# EAGLE design mixer1_1st auto route (EAGLE 7.3.0)
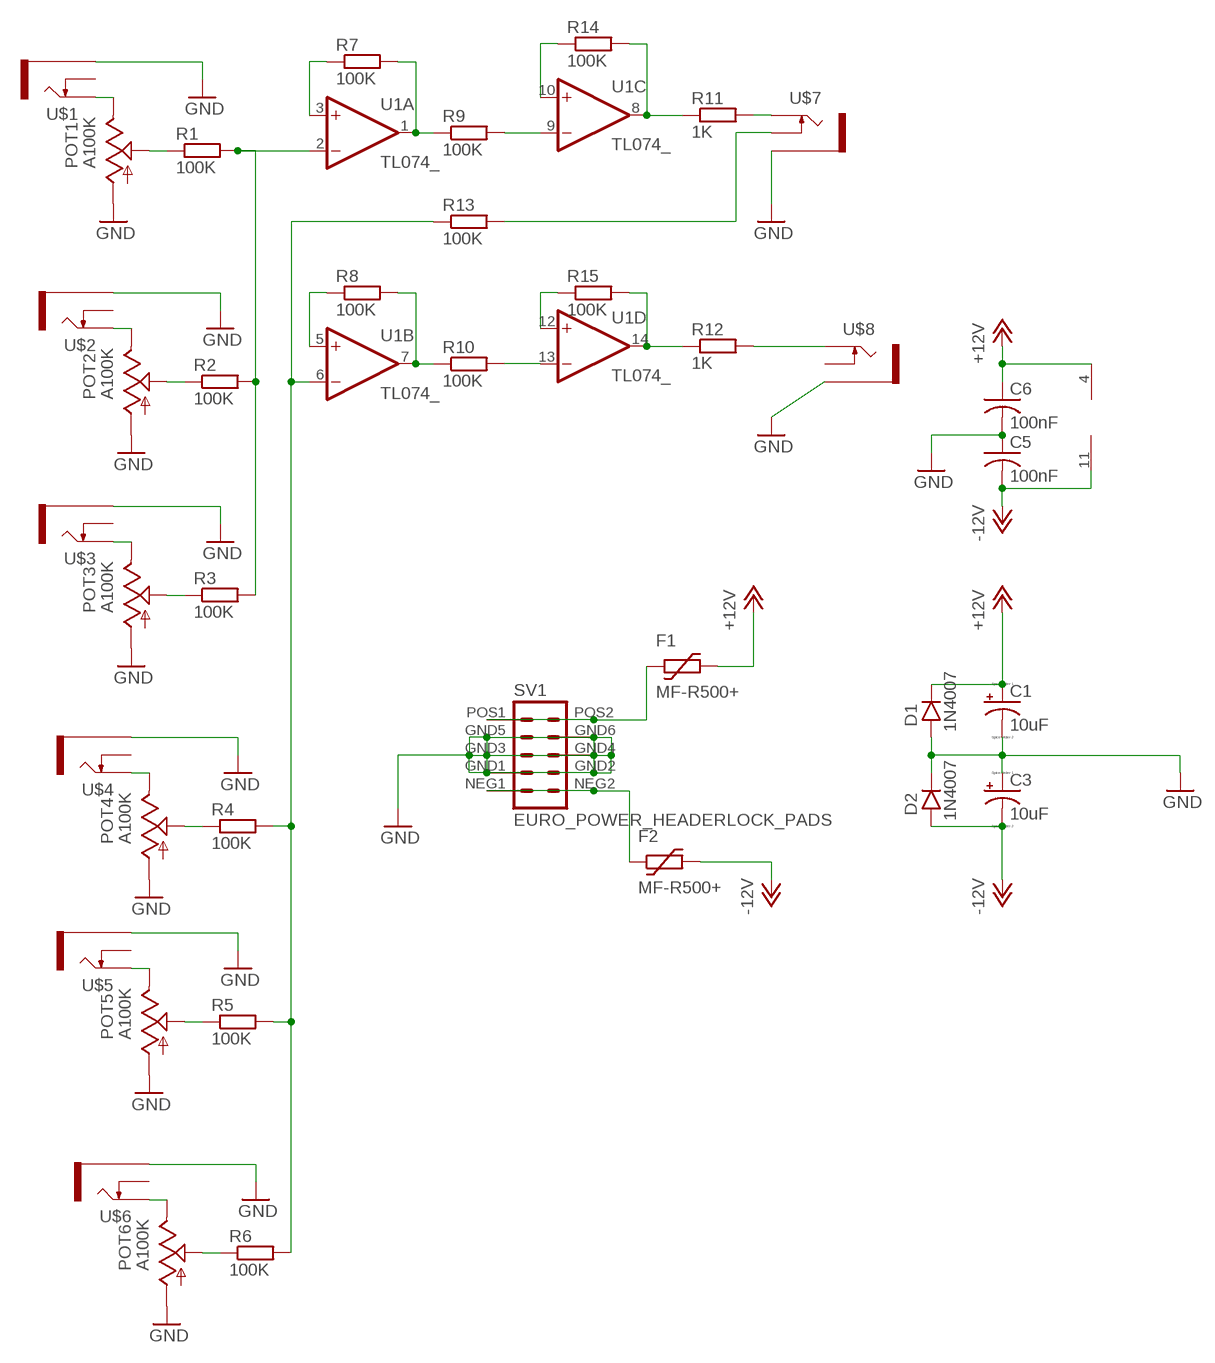
[diagram p0: schematic, sheet 1]

## Parts
C1  10uF  CPOL-USE2.5-7  [E2,5-7]
C3  10uF  CPOL-USE2.5-7  [E2,5-7]
C5  100nF  C-US075-032X103  [C075-032X103]
C6  100nF  C-US075-032X103  [C075-032X103]
D1  1N4007  1N400X.3  [DO41-3]
D2  1N4007  1N400X.3  [DO41-3]
F1  MF-R500+  [BOURNS-MF-R]
F2  MF-R500+  [BOURNS-MF-R]
POT1  A100K  9MM_SNAP-IN_POT_  [9MM_SNAP-IN_POT]
POT2  A100K  9MM_SNAP-IN_POT_  [9MM_SNAP-IN_POT]
POT3  A100K  9MM_SNAP-IN_POT_  [9MM_SNAP-IN_POT]
POT4  A100K  9MM_SNAP-IN_POT_  [9MM_SNAP-IN_POT]
POT5  A100K  9MM_SNAP-IN_POT_  [9MM_SNAP-IN_POT]
POT6  A100K  9MM_SNAP-IN_POT_  [9MM_SNAP-IN_POT]
R1  100K  RESISTOR7MM  [7MM_RESISTOR]
R2  100K  RESISTOR7MM  [7MM_RESISTOR]
R3  100K  RESISTOR7MM  [7MM_RESISTOR]
R4  100K  RESISTOR7MM  [7MM_RESISTOR]
R5  100K  RESISTOR7MM  [7MM_RESISTOR]
R6  100K  RESISTOR7MM  [7MM_RESISTOR]
R7  100K  RESISTOR7MM  [7MM_RESISTOR]
R8  100K  RESISTOR7MM  [7MM_RESISTOR]
R9  100K  RESISTOR7MM  [7MM_RESISTOR]
R10  100K  RESISTOR7MM  [7MM_RESISTOR]
R11  1K  RESISTOR7MM  [7MM_RESISTOR]
R12  1K  RESISTOR7MM  [7MM_RESISTOR]
R13  100K  RESISTOR7MM  [7MM_RESISTOR]
R14  100K  RESISTOR7MM  [7MM_RESISTOR]
R15  100K  RESISTOR7MM  [7MM_RESISTOR]
SV1  EURO_POWER_HEADERLOCK_PADS  [EURO_PWR_HEADER_LOCK]
U1  TL074_  [DIL14]
U$1  THONKICONNNEW  [WQP-PJ301M-12_JACK]
U$2  THONKICONNNEW  [WQP-PJ301M-12_JACK]
U$3  THONKICONNNEW  [WQP-PJ301M-12_JACK]
U$4  THONKICONNNEW  [WQP-PJ301M-12_JACK]
U$5  THONKICONNNEW  [WQP-PJ301M-12_JACK]
U$6  THONKICONNNEW  [WQP-PJ301M-12_JACK]
U$7  THONKICONNNEW  [WQP-PJ301M-12_JACK]
U$8  THONKICONNNEW  [WQP-PJ301M-12_JACK]

## Nets
+12V: C1.+ C6.1 D1.C F1.P$2 U1.4(P:V+)
-12V: C3.- C5.2 D2.A F2.P$2 U1.11(P:V-)
GND: C1.- C3.+ C5.1 C6.2 D1.A D2.C POT1.1(A) POT2.1(A) POT3.1(A) POT4.1(A) POT5.1(A) POT6.1(A) SV1.GND1 SV1.GND2 SV1.GND3 SV1.GND4 SV1.GND5 SV1.GND6 U$1.P$3_SLEEVE(SLEEVE) U$2.P$3_SLEEVE(SLEEVE) U$3.P$3_SLEEVE(SLEEVE) U$4.P$3_SLEEVE(SLEEVE) U$5.P$3_SLEEVE(SLEEVE) U$6.P$3_SLEEVE(SLEEVE) U$7.P$3_SLEEVE(SLEEVE) U$8.P$3_SLEEVE(SLEEVE)
N$1: POT2.3(E) U$2.P$1_TIP(TIP)
N$2: POT2.2(S) R2.1
N$3: POT1.3(E) U$1.P$1_TIP(TIP)
N$4: POT1.2(S) R1.1
N$5: POT3.3(E) U$3.P$1_TIP(TIP)
N$6: POT3.2(S) R3.1
N$7: POT4.3(E) U$4.P$1_TIP(TIP)
N$8: POT4.2(S) R4.1
N$9: POT5.3(E) U$5.P$1_TIP(TIP)
N$10: POT5.2(S) R5.1
N$11: POT6.3(E) U$6.P$1_TIP(TIP)
N$12: POT6.2(S) R6.1
N$13: R1.2 R2.2 R3.2 U1.2(A:-IN)
N$14: R7.1 U1.3(A:+IN)
N$15: R7.2 R9.1 U1.1(A:OUT)
N$16: R9.2 U1.9(C:-IN)
N$17: R14.1 U1.10(C:+IN)
N$18: R11.2 U$7.P$1_TIP(TIP)
N$19: R8.2 R10.1 U1.7(B:OUT)
N$20: R8.1 U1.5(B:+IN)
N$21: R15.1 U1.12(D:+IN)
N$22: R12.1 R15.2 U1.14(D:OUT)
N$23: R10.2 U1.13(D:-IN)
N$24: R4.2 R5.2 R6.2 R13.1 U1.6(B:-IN)
N$25: R11.1 R14.2 U1.8(C:OUT)
N$26: R13.2 U$7.P$2_SWITCH(SWITCH)
N$27: R12.2 U$8.P$1_TIP(TIP)
N$31: F2.P$1 SV1.NEG1 SV1.NEG2
N$32: F1.P$1 SV1.POS1 SV1.POS2
Unconnected: U$1.P$2_SWITCH(SWITCH) U$2.P$2_SWITCH(SWITCH) U$3.P$2_SWITCH(SWITCH) U$4.P$2_SWITCH(SWITCH) U$5.P$2_SWITCH(SWITCH) U$6.P$2_SWITCH(SWITCH) U$8.P$2_SWITCH(SWITCH)

## Library data of the parts
C1 C3 = resistor:CPOL-US: POLARIZED CAPACITOR, American symbol
C5 C6 = resistor:C-US: CAPACITOR, American symbol
D1 D2 = gm-diodes:1N400X: Rectifier Diodes often used in power supply to prevent damage from reverse polarization
F1 F2 = ptc-littlefuse:MF-R500+: http://www.farnell.com/datasheets/1817521.pdf
POT1-POT6 = MusicThingModular:9MM_SNAP-IN_POT: 9mm vertical snap-in pot, Alpha / Panasonic style
R1-R15 = MusicThingModular:RESISTOR: Standard resistor, various versions
SV1 = MusicThingModular:EURO_POWER_HEADER: Power Header 10 pin power header for Eurorack Power Supplies Variants with fatter pads for easier soldering, and the LOCK variant which has 5mil offset pins to hold the component in place before soldering
U1 = MusicThingModular:TL074: Generic Quad Op Amp
U$1-U$8 = MusicThingModular:THONKICONN: 3.5mm socket for Eurorack modular synths

## Board
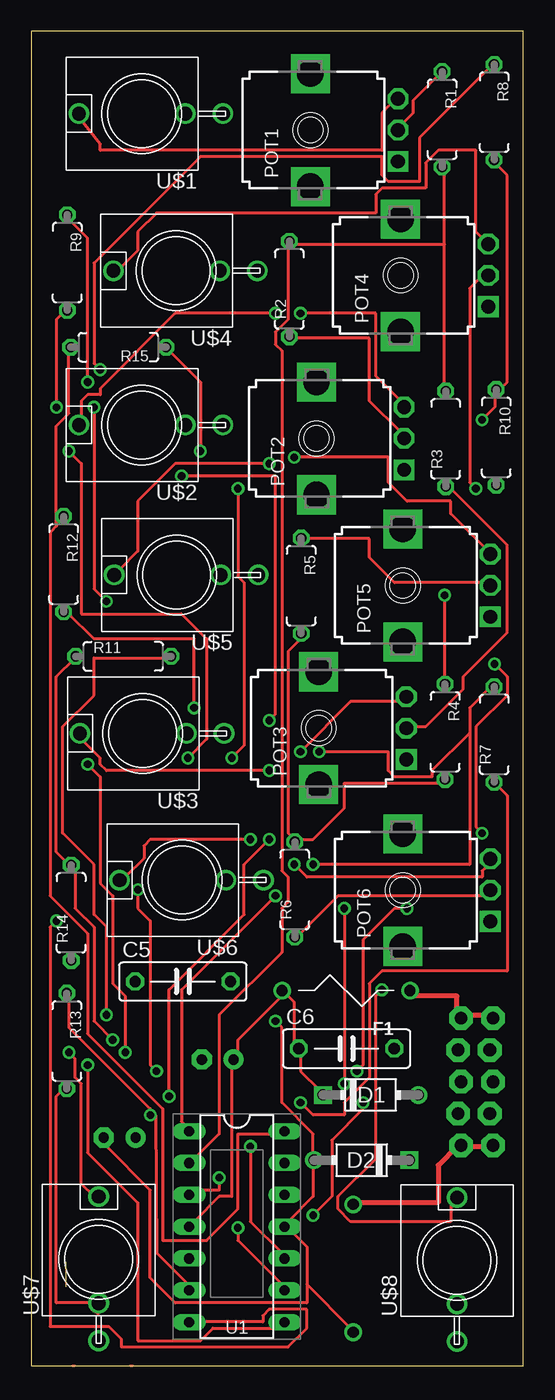
[diagram p1: board, top side]
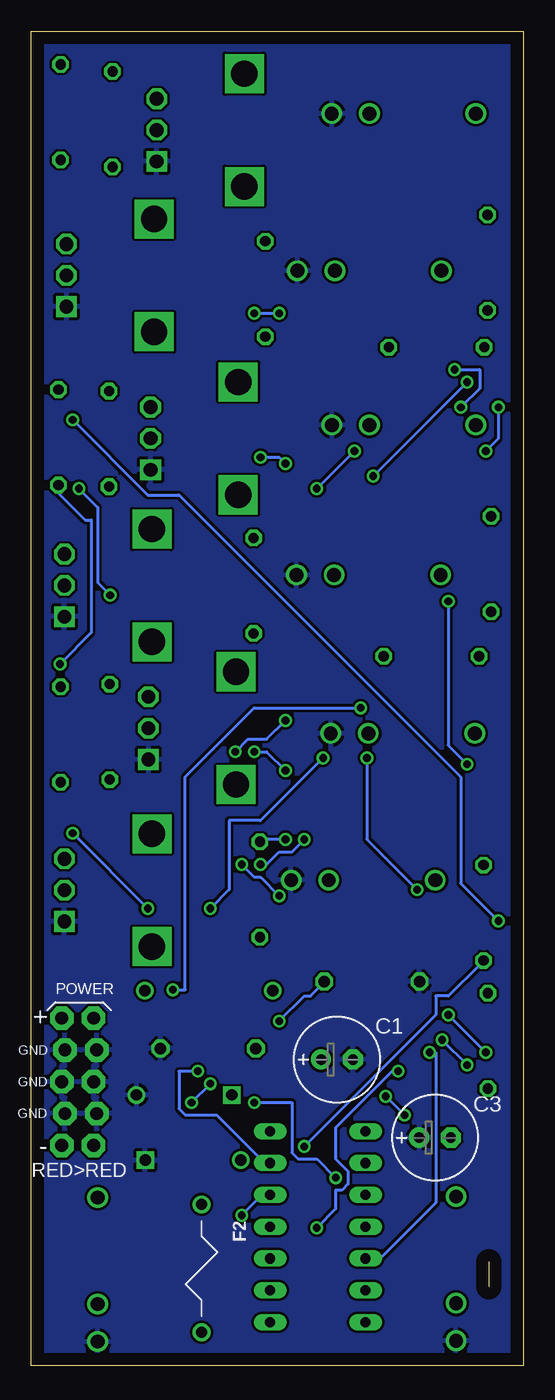
[diagram p2: board, bottom side, seen from below]

Size 39.3 x 106.5 mm. Coordinates in mm from the lower left corner, seen from the top.
Outline: 2.75,8.3 2.75,6.3
Outline: 0,0 39.3,0 39.3,106.5 0,106.5 0,0
Copper layers (1*16): Top 0.035mm / dielectric 1.5mm / Bottom 0.035mm
Design rules "default": minimum track width 10mil, minimum drill 24mil, track to track 8mil, track to pad 8mil, pad to pad 8mil, via to via 8mil, smd to smd 8mil, copper to edge 40mil, drill to drill 8mil, minimum pad ring 10mil, minimum via ring 8mil, stop-mask expansion 4mil, vias tented up to drill 0mil, thermal gap 10mil

### Footprints (pad centres in the part's own frame; a part is rotated, then mirrored left to right if it is on the bottom)
E2,5-7 = drill 0.813 pad 1.6: + -1.27,0 | drill 0.813 pad 1.6 octagon: - 1.27,0
C075-032X103 = drill 0.914 octagon: 1 -3.81,0; 2 3.81,0
DO41-3 = drill 0.9: A 3.81,0 | drill 0.9 square: C -3.81,0
BOURNS-MF-R = drill 0.9: P$1 -5.105,0; P$2 5.105,0
9MM_SNAP-IN_POT = drill 1.1 square: 1 -2.5,-7 | drill 1.1 octagon: 2 0,-7; 3 2.5,-7 | drill 2.1 square: CHASSIS1 -4.5,0; CHASSIS2 4.5,0
7MM_RESISTOR = drill 0.813 octagon: 1 -3.81,0; 2 3.81,0
EURO_PWR_HEADER_LOCK = drill 1.016 pad 1.88 octagon: GND1 -2.54,1.143; GND2 -2.54,-1.397; GND3 0,1.397; GND4 0,-1.143; GND5 2.54,1.143; GND6 2.54,-1.397; NEG1 -5.08,1.397; NEG2 -5.08,-1.143; POS1 5.08,1.397; POS2 5.08,-1.143
DIL14 = drill 0.813 long: 1 -7.62,-3.81; 2 -5.08,-3.81; 3 -2.54,-3.81; 4 0,-3.81; 5 2.54,-3.81; 6 5.08,-3.81; 7 7.62,-3.81; 8 7.62,3.81; 9 5.08,3.81; 10 2.54,3.81; 11 0,3.81; 12 -2.54,3.81; 13 -5.08,3.81; 14 -7.62,3.81
WQP-PJ301M-12_JACK = drill 1.1: P$1_TIP 0,5; P$2_SWITCH 0,-3.5; P$3_SLEEVE 0,-6.5

### Placement (x,y rotation side)
C1  14.89,24.43 0 bottom
C3  7.06,18.2 0 bottom
C5  12.1,30.66 0 top
C6  25.17,25.31 0 top
D1  27.09,21.61 0 top
D2  26.38,16.4 180 top
F1  25.13,29.94 180 top
F2  25.71,7.77 270 bottom
POT1  22.29,98.62 90 top
POT2  22.78,74.01 90 top
POT3  22.95,50.88 90 top
POT4  29.49,87.02 90 top
POT5  29.66,62.27 90 top
POT6  29.66,37.95 90 top
R1  32.81,99.48 270 top
R2  20.61,85.93 90 top
R3  33.09,73.97 90 top
R4  33.04,50.59 270 top
R5  21.55,62.26 270 top
R6  21.04,38 90 top
R7  36.96,50.38 90 top
R8  36.96,100.05 270 top
R9  2.87,88.04 270 top
R10  37.13,74.1 270 top
R11  7.35,56.62 0 top
R12  2.58,63.98 270 top
R13  2.84,25.92 270 top
R14  3.18,36.14 90 top
R15  6.95,81.29 180 top
SV1  35.47,22.66 90 bottom
U1  16.42,11.09 270 top
U$1  8.8,99.94 90 top
U$2  8.8,75.08 90 top
U$3  8.89,50.47 90 top
U$4  11.55,87.39 90 top
U$5  11.62,63.11 90 top
U$6  12.04,38.76 90 top
U$7  5.38,8.49 0 top
U$8  34,8.42 0 top

### Tracks (layer width: path | path; a pad name or v marks a point on that pad's centre or on a via)
+12V
  Top 0.254: D1.C 23,22 21.5,23.5 21.5,25 C6.1 21,25.5 21,29 20.5,29.5 F1.P$2 20,29.5 16.5,26 16.5,24.5 C1.+ 16,24 16,13.5 15,13.5 13,11.5 U1.4
-12V  (via drill 0.61)
  Top 0.254: 22,6.5 25.5,3 F2.P$2 | 22,6.5 22,9.5 20.5,11 U1.11 20.5,11.5 22.5,13.5 22.5,16 D2.A 22.5,16.5 22.5,18.5 20,21 20,27 v19.5,27.5 | 22,6.5 22,5 11.5,5 9.5,7 9.5,14 6,17.5 C3.-
  Bottom 0.254: v19.5,27.5 17.5,29.5 17,29.5 16,30.5 C5.2
GND
  pour Bottom (isolate 0.012): -0.88,107.72 -0.69,-1.14 40.98,-1.43 40.78,107.84
N$1  (via drill 0.61)
  Top 0.254: v19.5,84 11.5,84 5.5,78 5.5,77.5 4.5,77.5 4,77 4,75.5 U$2.P$1_TIP | v21.5,84 27.5,84 27.5,79 29.5,77 POT2.3
  Bottom 0.254: v21.5,84 v19.5,84
N$2
  Top 0.254: R2.1 21,82 27,82 27,77 29.5,74.5 POT2.2
N$3
  Top 0.254: U$1.P$1_TIP 3.82,99.6 5.5,97.5 5.5,97 28,97 28,100 29,101 POT1.3
N$4
  Top 0.254: R1.1 32.5,103 30.5,101 30.5,100 29.5,99 POT1.2
N$5  (via drill 0.61)
  Top 0.254: v19,47.5 6,47.5 5.5,48 5.5,48.5 4,50 U$3.P$1_TIP | v21.5,49 25.5,53 29.5,53 POT3.3
  Bottom 0.254: v19,47.5 20.5,49 v21.5,49
N$6
  Top 0.254: R3.1 33.5,70 38,65.5 38,58.5 34.5,55 34.5,54 31.5,51 30,51 POT3.2
N$7
  Top 0.254: U$4.P$1_TIP 7,87.5 8.5,89 8.5,90.5 10,92 27.5,92 27.5,93.5 28,94 31.5,94 31.5,96 32.5,97 35.5,97 35.5,90.5 36,90 POT4.3
N$8  (via drill 0.61)
  Top 0.254: v33,61.5 33,54.5 R4.1 | v35.5,70 35,70.5 35,86 36,87 POT4.2
  Bottom 0.254: v33,61.5 34,62.5 34,68.5 v35.5,70
N$9  (via drill 0.61)
  Top 0.254: v19,72 11.5,72 8.5,69 8.5,65 7,63.5 U$5.P$1_TIP | v21,72.5 28.5,72.5 28.5,70.5 30,69 33.5,69 33.5,68 36.5,65 POT5.3
  Bottom 0.254: v19,72 19.5,72.5 v21,72.5
N$10
  Top 0.254: R5.1 22,66 27,66 27,64.5 29,62.5 36.5,62.5 POT5.2
N$11  (via drill 0.61)
  Top 0.254: v17.5,42 9.5,42 9,41.5 9,40.5 7.5,39 U$6.P$1_TIP | v21,40 22,39 36,39 36,39.5 36.5,40 POT6.3
  Bottom 0.254: v17.5,42 18.5,41 19.5,41 20.5,40 v21,40
N$12
  Top 0.254: R6.1 21.5,34.5 24.5,37.5 36.5,37.5 POT6.2
N$13
  Top 0.254: 33,89.5 33,78 R3.2 | 33,89.5 33,95.5 R1.2 | U1.2 13,16.5 15,18.5 15,28 20,33 20,36.5 20.5,37 20.5,39 20,39.5 20,81 19.5,81.5 19.5,82.5 20.5,83.5 20.5,89.5 R2.2 21,89.5 33,89.5
N$14  (via drill 0.61)
  Top 0.254: v15,15 15,14 13,14 U1.3 | v21.5,21 22.5,20 25,20 25,21 27,23 27,30.5 28,31.5 38,31.5 38,45.5 37,46.5 R7.1
  Bottom 0.254: v15,15 16.5,16.5 18,16.5 18.5,17 18.5,21 v21.5,21
N$15  (via drill 0.61)
  Top 0.254: v19.5,37.5 12,30 12,19.5 12.5,19 U1.1 | v22.5,40 35,40 35,50.5 | 35,50.5 35,52.5 36.5,54 R7.2 | v4.5,78.5 4.5,90 3,91.5 R9.1 | v12,71 19.5,71 19.5,52 v19,51.5 | v23,49 28.5,49 28.5,47.5 29,47 32,47 32,47.5 35,50.5
  Bottom 0.254: v19.5,37.5 21,39 21.5,39 v22.5,40 | v12,71 v4.5,78.5 | v19,51.5 20.5,50 22,50 v23,49
N$16  (via drill 0.61)
  Top 0.254: v16.5,11 16.5,10 20,6.5 U1.9 | v10,23.5 9.5,24 9.5,35.5 8.5,36.5 v8.5,38 | v12.5,48.5 14,50 14,58 12,60 4,60 4,72 v3,73 | v2,76.5 2,83.5 2.5,84 R9.2
  Bottom 0.254: v16.5,11 15,12.5 15,14 14.5,14 14,14.5 14,15.5 15,16.5 15,19 10.5,23.5 v10,23.5 | v8.5,38 12.5,42 v12.5,48.5 | v3,73 2,74 v2,76.5
N$17  (via drill 0.61)
  Top 0.254: v17.5,17.5 17.5,11.5 20,9 U1.10
  Bottom 0.254: v17.5,17.5 7,28 7,29.5 6,29.5 3.5,32 R14.1
N$18  (via drill 0.61)
  Top 0.254: v6,28 6,35 5,36 5,40 2.5,42.5 2.5,51 5,53.5 5,56.5 11,56.5 R11.2 | v3,25 3.5,24.5 3.5,23 4,22.5 4,14.5 5,13.5 U$7.P$1_TIP
  Bottom 0.254: v3,25 v6,28
N$19  (via drill 0.61)
  Top 0.254: v2,35.5 1.5,35 1.5,3.13 6.18,3.13 7.18,2.13 7.18,1.5 20.5,1.5 22,3 22,4.5 19,4.5 18.5,4 18.5,3.5 13,3.5 U1.7 | v36,75.5 37,76.5 37,77.5 R10.1 37.5,78 38,78.5 38,95 37,96 R8.2
  Bottom 0.254: v2,35.5 5,38.5 5,47 27.5,69.5 30,69.5 v36,75.5
N$20  (via drill 0.61)
  Top 0.254: v7.5,25 7.5,29.5 6.5,30.5 6.5,37.5 5.5,38.5 5.5,47 v4.5,48 | v6,61 5,62 v5,76.5 | v5.5,79.5 5,80 5,88 13.5,96.5 28,96.5 28,95 28.5,94.5 31,94.5 31,98 36.5,103.5 R8.1
  Bottom 0.254: v7.5,25 7,25 7,13 11.5,8.5 12.5,8.5 U1.5 | v4.5,48 6,49.5 v6,61 | v5,76.5 3.5,78 3.5,79.5 v5.5,79.5
N$21  (via drill 0.61)
  Top 0.254: v22.5,12 24,13.5 24,18 26.5,20.5 v26.5,21 | v25,36.5 v25,22.5 | v16,48.5 17,49.5 17,62.5 16.5,63 v16.5,70 | v13.5,73 13.5,78.5 11,81 R15.1
  Bottom 0.254: v22.5,12 21,13.5 20.5,13.5 U1.12 | v25,22.5 v26.5,21 | v25,36.5 23.5,38 23.5,43.5 21,43.5 v16,48.5 | v13.5,73 v16.5,70
N$22
  Top 0.254: 2,67 2.5,67.5 R12.1 | 2,67 1.5,66.5 1.5,37.5 4.5,34.5 4.5,26.5 10.5,20.5 10.5,10 14,10 16.5,12.5 16.5,18.5 20,18.5 U1.14 | 2,67 2,75 3,76 3,81 R15.2
N$23  (via drill 0.61)
  Top 0.254: v26,23.5 26.5,24 26.5,34 29,36.5 v30,36.5 | v36,42.5 35.5,43 35.5,51 38,53.5 38,55 v37,56
  Bottom 0.254: v26,23.5 27.5,23.5 27.5,20.5 27,20 24.5,20 21,16.5 20.5,16.5 U1.13 | v36,42.5 v30,36.5 | v37,56 34.5,58.5 34.5,67.5 35,67.5 37.5,70 R10.2
N$24  (via drill 0.61)
  Top 0.254: R5.2 21.5,58 20.5,57 20.5,42.5 21,42 R6.2 21.5,42 22.5,42 25,44.5 25,46.5 33,46.5 R4.2 | 9.5,20.5 3,27 3,29.5 R13.1 | 9.5,20.5 9.93,19.98 10,9 12.5,6.5 U1.6 | v19,42 17,40 17,36 11,30 v11,21.5 | 9.5,20.5 v9.5,20
  Bottom 0.254: v19,42 21,42 R6.2 | v9.5,20 v11,21.5
N$25  (via drill 0.61)
  Top 0.254: v4.5,24 4.5,17 8.5,13 8.5,2 13.5,2 14.5,3 20,3 U1.8 | v6.5,26 5,27.5 5,35 3.5,36.5 3.5,39.5 R14.2 3,40 2,41 2,55 3.5,56.5 R11.1
  Bottom 0.254: v6.5,26 v4.5,24
N$26
  Top 0.254: R13.2 2.5,22 2,21.5 2,5 5,5 U$7.P$2_SWITCH
N$27  (via drill 0.61)
  Top 0.254: v13,52.5 13,58 5,58 3,60 R12.2 | v28,30 27.5,29.5 27.5,16.5 24.5,13.5 24.5,12.5 25.5,11.5 33.5,11.5 33.5,13 U$8.P$1_TIP
  Bottom 0.254: v13,52.5 21.5,52.5 27,47 27,30 v28,30
N$30
  Top 0.2: 5.34,4.16 4.82,4.47
N$31
  Top 0.254: 34.5,17.5 SV1.NEG2
  Top 0.406: F2.P$1 26,13 32.5,13 32.5,16 34,17.5 SV1.NEG2 | 34.5,17.5 36.5,17.5 SV1.NEG1
N$32
  Top 0.254: 30.5,29.5 F1.P$1 | 34.5,28 SV1.POS2
  Top 0.406: 30.5,29.5 34,29.5 34,28 SV1.POS2 | 34.5,28 36.5,28 SV1.POS1
N$40
  Top 0.2: 3.29,0 3.45,0
N$42
  Top 0.2: 7.95,0 8.1,0